# EAGLE schematic N2a (EAGLE 6.6.0)
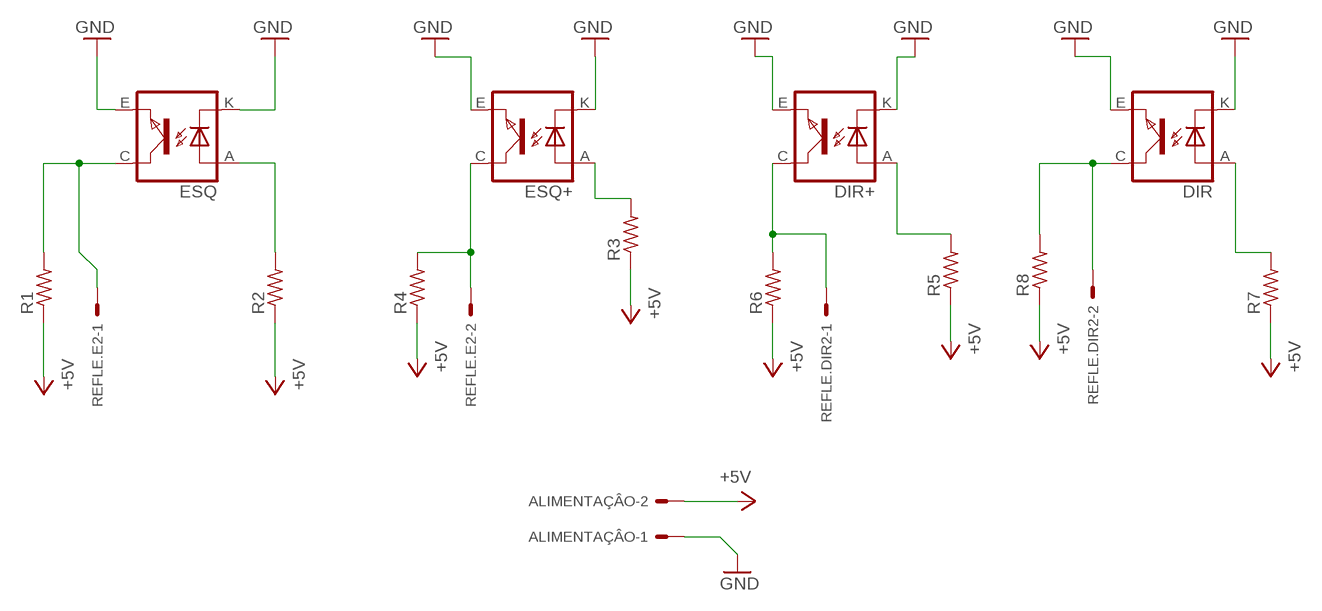
[diagram p0: schematic, sheet 1]

## Parts
ALIMENTAÇÂO  CONN_0205-7028  [7395-02]
DIR  TCRT5000  [TCRT5000]
DIR+  TCRT5000  [TCRT5000]
ESQ  TCRT5000  [TCRT5000]
ESQ+  TCRT5000  [TCRT5000]
R1  R-US_0204/7  [0204/7]
R2  R-US_0204/7  [0204/7]
R3  R-US_0204/7  [0204/7]
R4  R-US_0204/7  [0204/7]
R5  R-US_0204/7  [0204/7]
R6  R-US_0204/7  [0204/7]
R7  R-US_0204/7  [0204/7]
R8  R-US_0204/7  [0204/7]
REFLE.DIR2  CONN_0205-7028  [7395-02]
REFLE.E2  CONN_0205-7028  [7395-02]

## Nets
+5V: ALIMENTAÇÂO.2 R1.1 R2.1 R3.1 R4.1 R5.1 R6.1 R7.1 R8.1
GND: ALIMENTAÇÂO.1 DIR+.E(EMITTER) DIR+.K(CATHODE) DIR.E(EMITTER) DIR.K(CATHODE) ESQ+.E(EMITTER) ESQ+.K(CATHODE) ESQ.E(EMITTER) ESQ.K(CATHODE)
N$1: ESQ+.C(COLLECTOR) R4.2 REFLE.E2.2
N$2: ESQ.C(COLLECTOR) R1.2 REFLE.E2.1
N$3: ESQ+.A(ANODE) R3.2
N$4: DIR+.A(ANODE) R5.2
N$5: DIR+.C(COLLECTOR) R6.2 REFLE.DIR2.1
N$6: DIR.A(ANODE) R7.2
N$7: DIR.C(COLLECTOR) R8.2 REFLE.DIR2.2
N$9: ESQ.A(ANODE) R2.2

## Library data of the parts
ALIMENTAÇÂO REFLE.DIR2 REFLE.E2 = Robotica-IFRN-SC-conectores:CONN_02: CONNECTOR wire to board 2.54 mm (.1 inch) pitch header; OC_FARNELL: 9731601; OC_NEWARK: unknown
DIR DIR+ ESQ ESQ+ = Robotica-IFRN-SC-sensores:TCRT5000
R1-R8 = rcl:R-US_: RESISTOR, American symbol; SPICEPREFIX: R